# Altium schematic sheet USB_OTG_FS.SchDoc: USB_OTG_FS
size A4; DocumentNumber: MB1219; Revision: B.1; SheetNumber: 9; SheetTotal: 17; Project: STM32F769I-EVAL
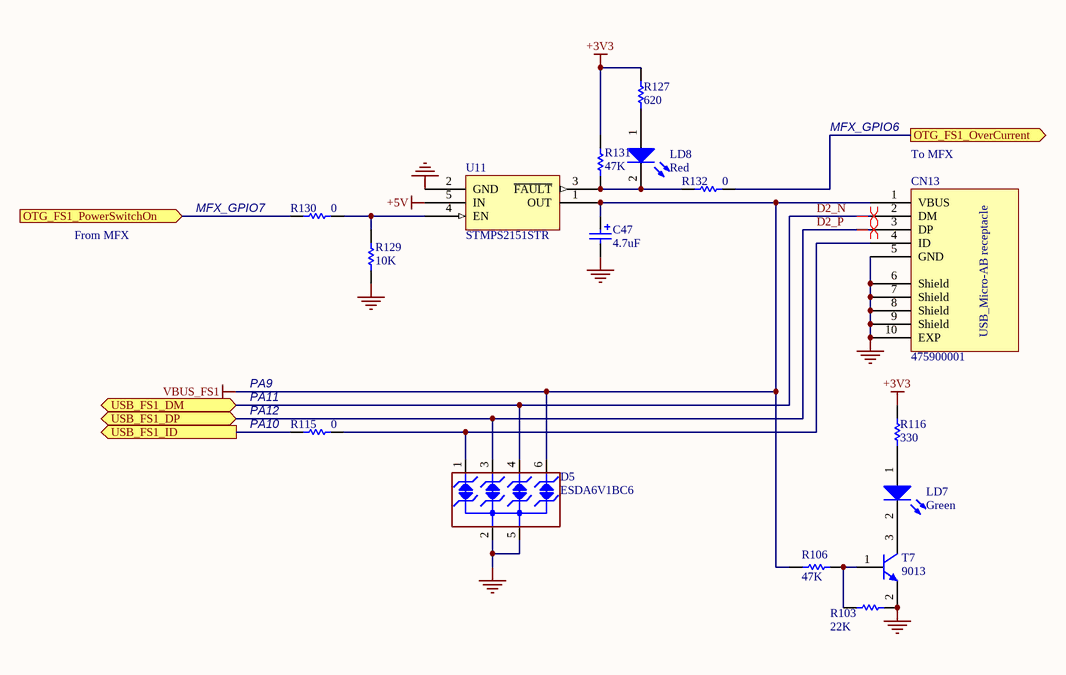
[diagram p0: USB_OTG_FS.SchDoc]

## Parts
C47  4.7uF  [TAN-A]
CN13  475900001  [MOLEX_47590001]
D5  ESDA6V1BC6  [SOT23-6]
LD7  Green  [0603D]
LD8  Red  [0603D]
R103  22K  [0603R]
R106  47K  [0603R]
R115  0  [0603R]
R116  330  [0603R]
R127  620  [0603R]
R129  10K  [0603R]
R130  0  [0603R]
R131  47K  [0603R]
R132  0  [0603R]
T7  9013  [SOT-23]
U11  STMPS2151STR  [SOT23-5]

## Ports
OTG_FS1_OverCurrent (out), OTG_FS1_PowerSwitchOn (in), USB_FS1_DM (bidir), USB_FS1_DP (bidir), USB_FS1_ID (out)

## Nets
+3V3: R116.2 R127.2 R131.1
+5V: U11.5(IN)
GND: C47.2 CN13.5(GND) CN13.6(Shield) CN13.7(Shield) CN13.8(Shield) CN13.9(Shield) CN13.10(EXP) D5.2(IO2) D5.5(IO4) R103.1 R129.1 T7.2(E) U11.2(GND)
VBUS_FS1: C47.1 CN13.1(VBUS) D5.6(NC) R106.1 U11.1(OUT)
D2_N: CN13.2(DM) D5.4(IO3) ; port USB_FS1_DM
D2_P: CN13.3(DP) D5.3(GND) ; port USB_FS1_DP
OTG_FS1_OverCurrent: R132.1 ; port OTG_FS1_OverCurrent
OTG_FS1_PowerSwitchOn: R130.2 ; port OTG_FS1_PowerSwitchOn
USB_FS1_ID: R115.2 ; port USB_FS1_ID
NetCN13_4: CN13.4(ID) D5.1(IO1) R115.1
NetLD7_1: LD7.1(A) R116.1
NetLD7_2: LD7.2(K) T7.3(C)
NetLD8_1: LD8.1(A) R127.1
NetLD8_2: LD8.2(K) R131.2 R132.2 U11.3(~{FAULT})
NetR103_2: R103.2 R106.2 T7.1(B)
NetR129_2: R129.2 R130.1 U11.4(EN)

## Layout directives
differential pair: D2_N, D2_P

## Notes on the sheet
- MFX_GPIO6
- (near R130) MFX_GPIO7
- (near CN13) To MFX
- From MFX
- PA9
- (near R115) PA11
- (near R115) PA12
- (near R115) PA10
- Title:
- Project:
- Size:
- Date:
- A4
- Reference:
- Sheet:
- Revision:
- of
- (in symbol 475900001) USB_Micro-AB receptacle

## Library data of the parts
C47 = Cap Pol1: Polarized Capacitor (Radial); Value: 47uF; Published: 8-Jun-2000; Revision: July-2002: Re-released for DXP Platform.; Publisher: Altium Limited
D5 = ESDA6V1BC6: 4-line ESD protection; Manuf_1: STM; Manuf_Part_1: ESDA5V3L; Description: Dual Transil array for ESD protection; Ref St: 9179034; Provided: ST; ECCN_US/EU: EAR99/NEC; Distrib: ST; Order: ESDA5V3L; Ordered by: STM
LD7 LD8 = LED2: Typical RED, GREEN, YELLOW, AMBER GaAs LED; Published: 8-Jun-2000; Revision: July-2002: Re-released for DXP Platform.; Publisher: Altium Limited
R103 R106 R116 R131 = res1: Resistor; Value: 1K; Published: 8-Jun-2000; Revision: July-2002: Re-released for DXP Platform.; Publisher: Altium Limited
R115 R127 R129 R130 R132 = Res1: Resistor; Value: 1K; Published: 8-Jun-2000; Revision: July-2002: Re-released for DXP Platform.; Publisher: Altium Limited
T7 = NPN: NPN Bipolar Transistor; Code - JEDEC: TO-226-AA; Published: 8-Jun-2000; Revision: July-2002: Re-released for DXP Platform.; Publisher: Altium Limited
U11 = STMPS2141STR